# Altium schematic sheet TMS570LS0914_ports.SchDoc: TMS570LS0914 Ports
size Letter; SheetNumber: 7; SheetTotal: 11
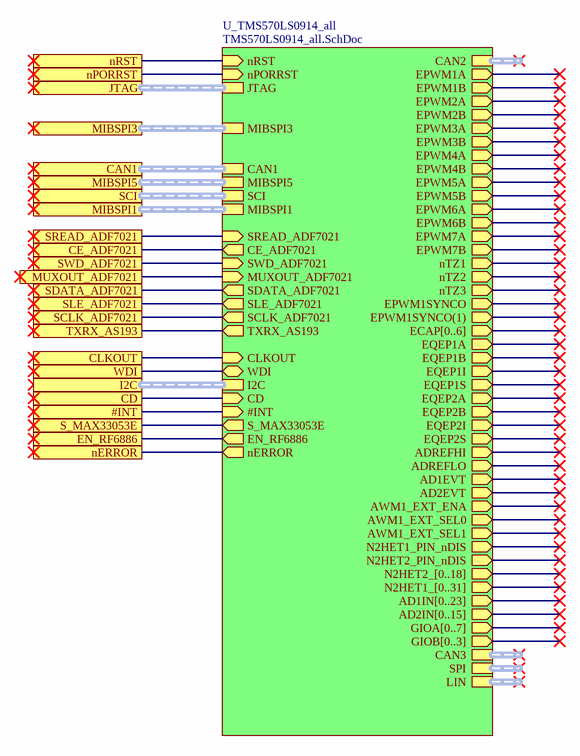
[diagram p0: TMS570LS0914_ports.SchDoc]

## Sub-sheets
U_TMS570LS0914_all = TMS570LS0914_all.SchDoc: nERROR (out), nRST (in), nPORRST (in), JTAG (harness TMS570_JTAG), CAN2 (harness TMS570_CAN2), CAN3 (harness TMS570_CAN3), EPWM1A (out), EPWM1B (out), EPWM2A (out), EPWM2B (out), EPWM3A (out), EPWM3B (out), EPWM4A (out), EPWM4B (out), EPWM5A (out), EPWM5B (out), EPWM6A (out), EPWM6B (out), EPWM7A (out), EPWM7B (out), nTZ1 (out), nTZ2 (out), nTZ3 (out), EPWM1SYNCO (out), EPWM1SYNCO(1) (out), ECAP[0..6] (out), EQEP1A (out), EQEP1B (out), EQEP1I (out), EQEP1S (out), EQEP2A (out), EQEP2B (out), EQEP2I (out), EQEP2S (out), MIBSPI3 (harness TMS570_MIBSPI3), LIN (harness TMS570_LIN), SPI (harness TMS570_SPI), CAN1 (harness TMS570_CAN1), MIBSPI5 (harness TMS570_MIBSPI5), SCI (harness TMS570_SCI), I2C (harness TMS570_I2C), MIBSPI1 (harness TMS570_MIBSPI1), ADREFHI (out), ADREFLO (out), AD1EVT (out), AD2EVT (out), AWM1_EXT_ENA (out), AWM1_EXT_SEL0 (out), AWM1_EXT_SEL1 (out), N2HET1_PIN_nDIS (out), N2HET2_PIN_nDIS (out), N2HET2_[0..18] (out), N2HET1_[0..31] (out), AD1IN[0..23] (out), AD2IN[0..15] (out), GIOA[0..7] (out), GIOB[0..3] (out), SREAD_ADF7021 (in), SWD_ADF7021 (in), MUXOUT_ADF7021 (in), CE_ADF7021 (out), SDATA_ADF7021 (out), SLE_ADF7021 (out), SCLK_ADF7021 (out), TXRX_AS193 (out), S_MAX33053E (out), EN_RF6886 (out), CD (in), #INT (in), CLKOUT (in), WDI (bidir)

## Ports
#INT, CAN1, CD, CE_ADF7021, CLKOUT, EN_RF6886, I2C (harness MCU_I2C0), JTAG, MIBSPI1, MIBSPI3, MIBSPI5, MUXOUT_ADF7021, nERROR, nPORRST, nRST, S_MAX33053E, SCI, SCLK_ADF7021, SDATA_ADF7021, SLE_ADF7021, SREAD_ADF7021, SWD_ADF7021, TXRX_AS193, WDI

## Nets
#INT: port #INT, sheet U_TMS570LS0914_all/#INT
CD: port CD, sheet U_TMS570LS0914_all/CD
CE_ADF7021: port CE_ADF7021, sheet U_TMS570LS0914_all/CE_ADF7021
CLKOUT: port CLKOUT, sheet U_TMS570LS0914_all/CLKOUT
EN_RF6886: port EN_RF6886, sheet U_TMS570LS0914_all/EN_RF6886
MUXOUT_ADF7021: port MUXOUT_ADF7021, sheet U_TMS570LS0914_all/MUXOUT_ADF7021
nERROR: port nERROR, sheet U_TMS570LS0914_all/nERROR
nPORRST: port nPORRST, sheet U_TMS570LS0914_all/nPORRST
nRST: port nRST, sheet U_TMS570LS0914_all/nRST
S_MAX33053E: port S_MAX33053E, sheet U_TMS570LS0914_all/S_MAX33053E
SCLK_ADF7021: port SCLK_ADF7021, sheet U_TMS570LS0914_all/SCLK_ADF7021
SDATA_ADF7021: port SDATA_ADF7021, sheet U_TMS570LS0914_all/SDATA_ADF7021
SLE_ADF7021: port SLE_ADF7021, sheet U_TMS570LS0914_all/SLE_ADF7021
SREAD_ADF7021: port SREAD_ADF7021, sheet U_TMS570LS0914_all/SREAD_ADF7021
SWD_ADF7021: port SWD_ADF7021, sheet U_TMS570LS0914_all/SWD_ADF7021
TXRX_AS193: port TXRX_AS193, sheet U_TMS570LS0914_all/TXRX_AS193
WDI: port WDI, sheet U_TMS570LS0914_all/WDI

## Buses and harness runs
harness port CAN1 = sheet U_TMS570LS0914_all/CAN1
harness port I2C = sheet U_TMS570LS0914_all/I2C
harness port JTAG = sheet U_TMS570LS0914_all/JTAG
harness port MIBSPI1 = sheet U_TMS570LS0914_all/MIBSPI1
harness port MIBSPI3 = sheet U_TMS570LS0914_all/MIBSPI3
harness port MIBSPI5 = sheet U_TMS570LS0914_all/MIBSPI5
harness port SCI = sheet U_TMS570LS0914_all/SCI

## Notes on the sheet
- (the "License"); you may not use or redistribute this file except in compliance with the License. You
- This file and the information within it are licensed under the terms of the Apache License, Version 2.0
- Copyright
- Unless required by applicable law or agreed to in writing, content distributed under the License is
- distributed on an "AS IS" BASIS, WITHOUT WARRANTIES OR CONDITIONS OF ANY KIND,
- either express or implied. See the License for the specific language governing permissions and
- limitations under the License.
- may obtain a copy of the License at:
- http://www.apache.org/licenses/LICENSE-2.0
- Title
- Size:
- Date:
- Letter
- Number:
- Time:
- Revision:
- Sheet
- of
- University of Alberta
- Deptartment of Electrical
- and Computer Engineering
- Edmonton AB, Canada
- T6G 1H9
- File: